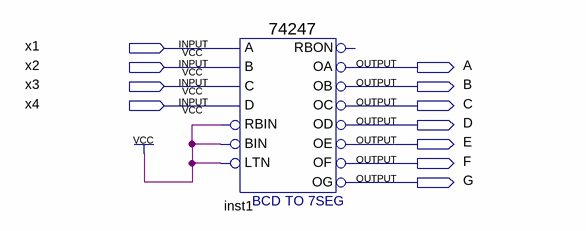
[diagram p0: schematic sheet]
// Quartus schematic scheme3.bdf as structural Verilog: 1 symbols, 11 pins
module scheme3 (
  input  x1,
  input  x2,
  input  x3,
  input  x4,
  output A,
  output B,
  output C,
  output D,
  output E,
  output F,
  output G
);

  \74247  inst1 (
    .LTN(1'b1), .BIN(1'b1), .A(x1), .B(x2), .RBIN(1'b1), .C(x3), .D(x4), .OF(F), .OC(C), .OD(D), .OE(E),
    .OA(A), .OB(B), .OG(G));  // open: RBON
endmodule
